# EasyEDA schematic SCH_Controller-12-volt-power_EasyEDA.json
TITLE: 12Volt Power for Controller; REV: 1.0; Date: 2024-10-01; Sheet: 1/1; Drawn By: scottguiness; Company: Scott and Marco
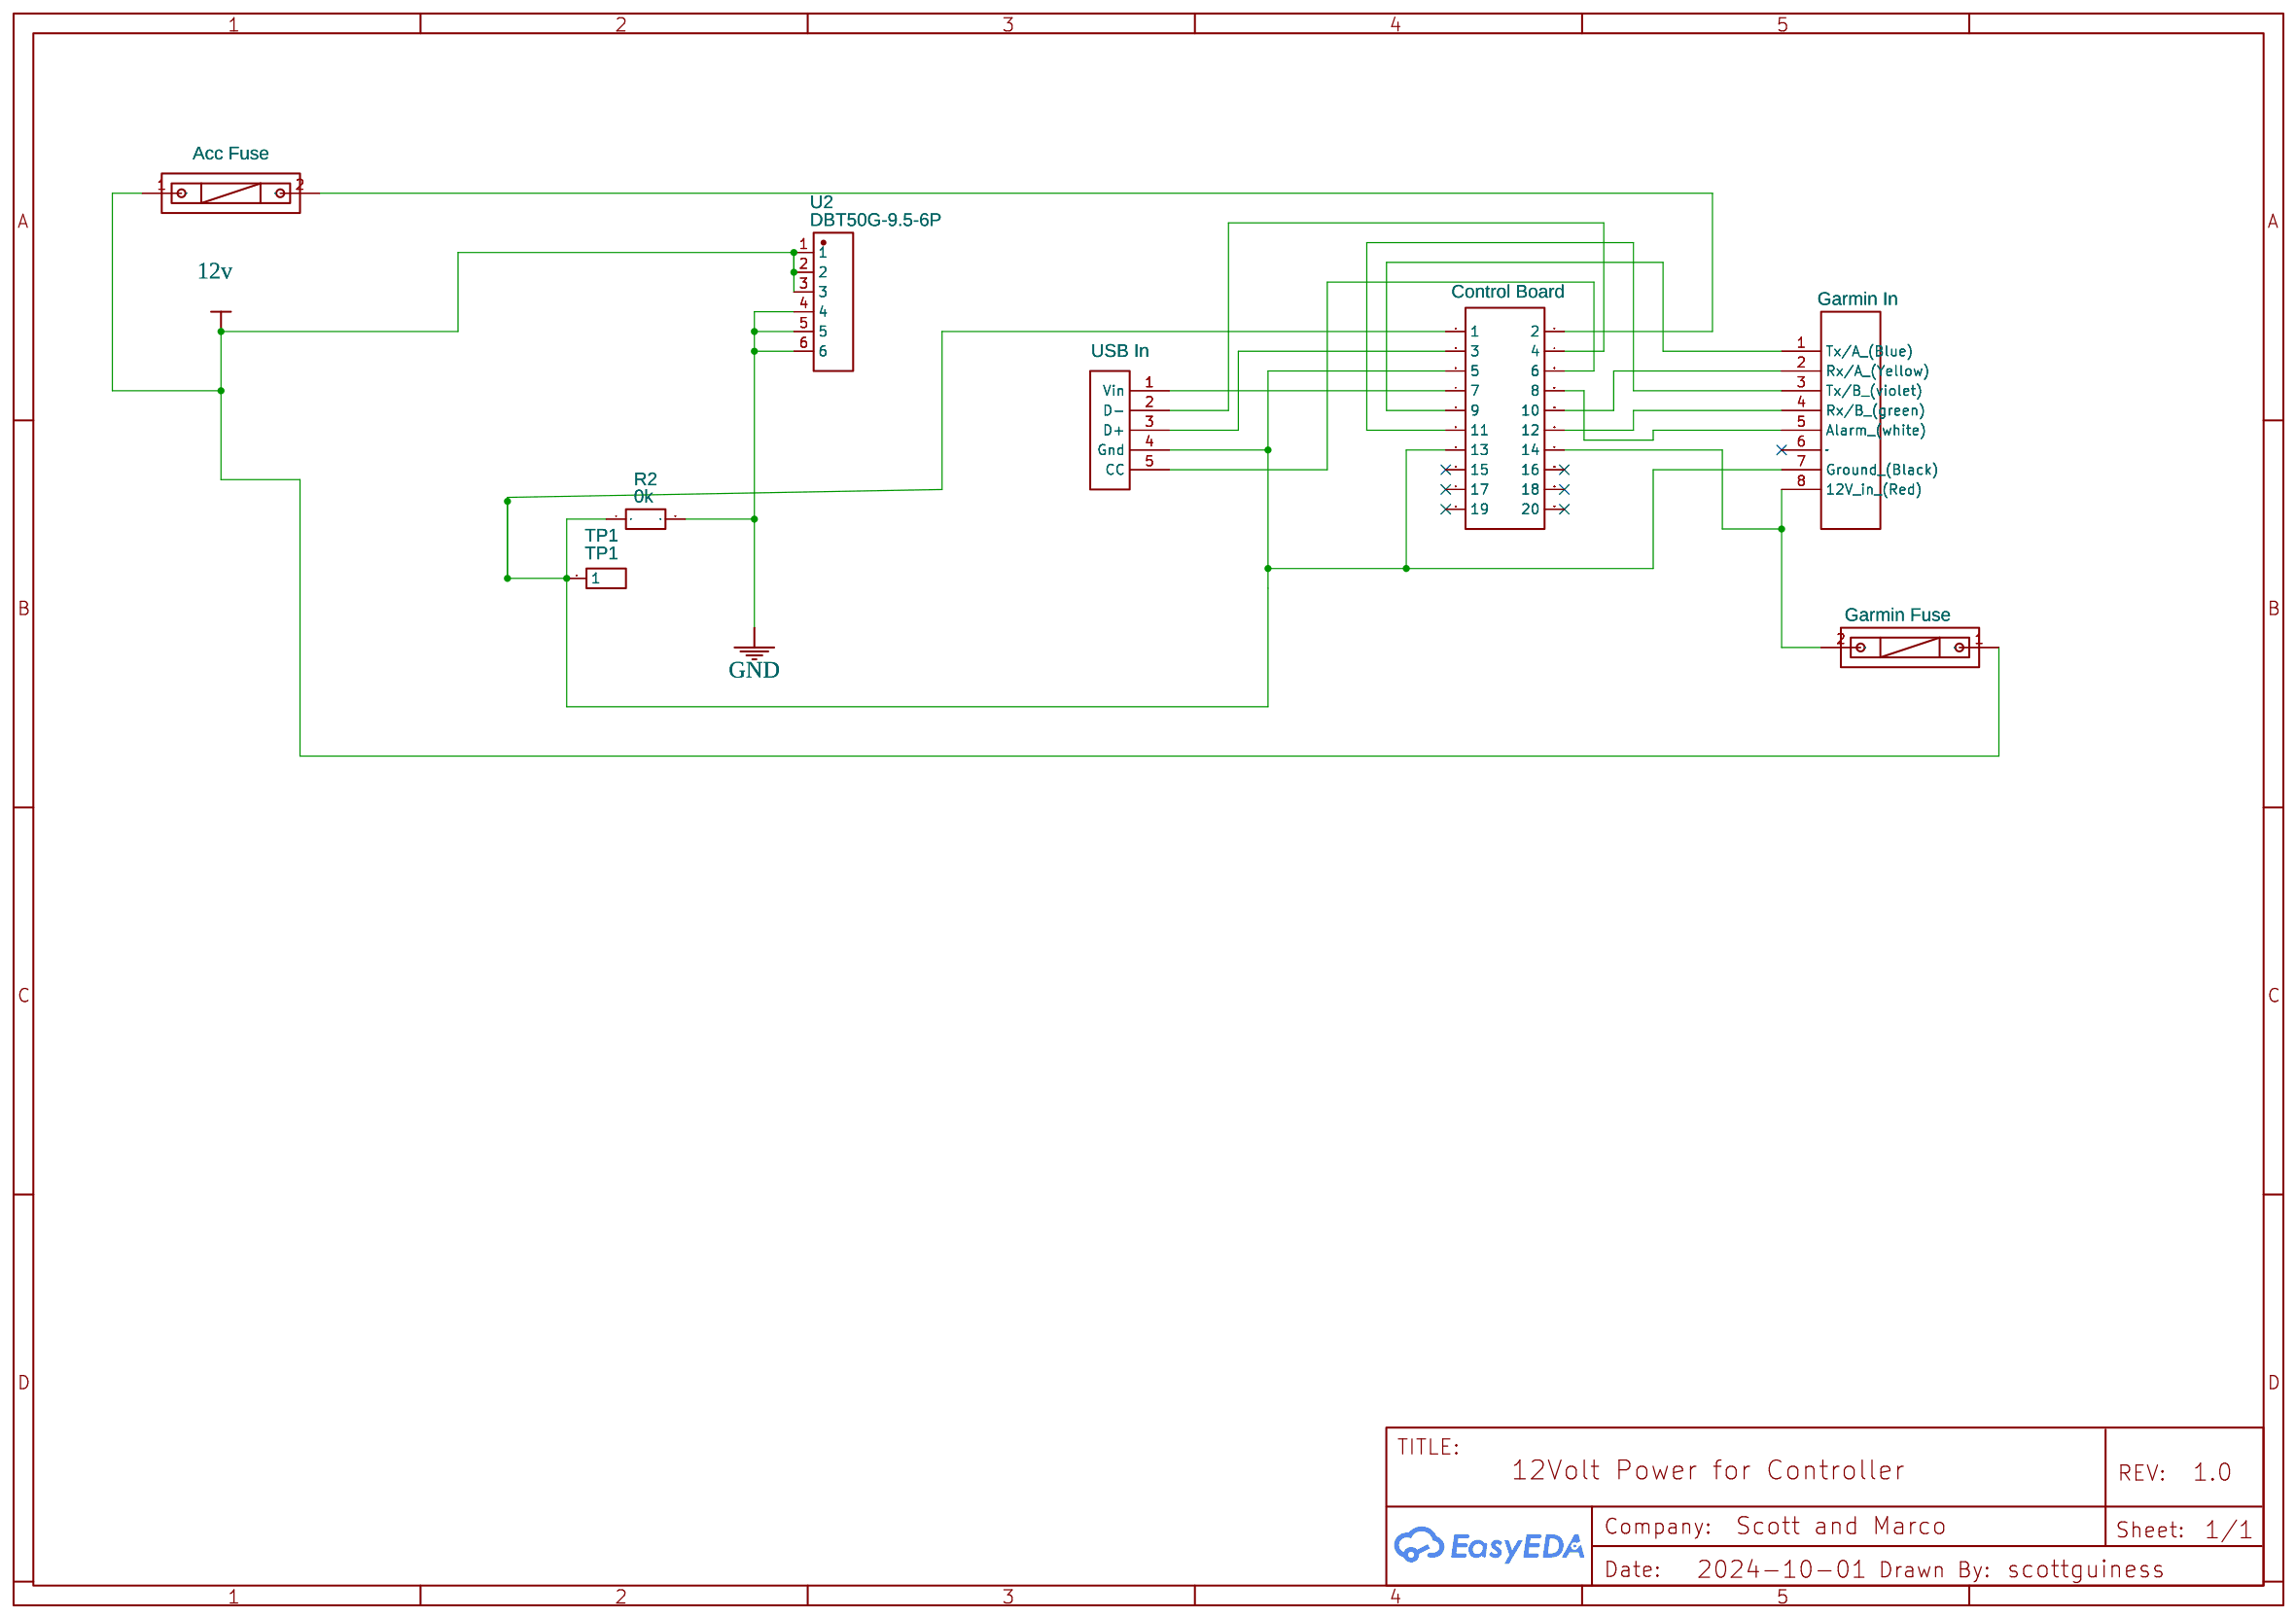
[diagram p0: schematic sheet]

## Parts
ACC-FUSE-5X20=BLX-ATYPE-FUSE-HOLDER  Acc Fuse  [FUSE-TH_L22.6-W9.0]
BUTTON_LED1  Control Board  [HDR-M-2.54_2X10]
GARMIN-FUSE-5X20-BLX-ATYPE-FUSE-HOLDER  Garmin Fuse  [FUSE-TH_L22.6-W9.0]
GARMIN-GPS  Garmin In  [JST-XH-8PIN-2.5]
R2  0k  [R_AXIAL-0.3]
TP1  TP1  [HDR-M-2.54_1X1]
U2  DBT50G-9.5-6P  [CONN-TH_6P-P9.50_DBT50G-9.5-6P]
USB-C  USB In  [JST XH 1X5]

## Library data of the parts
ACC-FUSE-5X20=BLX-ATYPE-FUSE-HOLDER GARMIN-FUSE-5X20-BLX-ATYPE-FUSE-HOLDER = 5x20 BLX-Atype Fuse holder XC-7: Supplier: LCSC; Manufacturer Part: 5x20 BLX-A型 保险丝支架 XC-7; Manufacturer: xcfuse(旭程); Supplier Part: C3131; JLCPCB Part Class: Extended Part
BUTTON_LED1 = HDR-M-2.54_2x10: Supplier Part: C124359; Supplier: LCSC; Contributor: LCEDA_Lib
GARMIN-GPS = 8PIN JST CONNECTOR: Manufacturer: Waveshare; Contributor: Robciog1968
R2 = R_AXIAL-0.3_EU: Contributor: LCEDA_Lib
TP1 = HDR-M-2.54_1x1: Supplier Part: C81276; Supplier: LCSC; Contributor: LCEDA_Lib; Package Display: No
U2 = DBT50G-9.5-6P: Contributor: LCSC; Supplier: LCSC; Supplier Part: C430698; Manufacturer: DORABO(地博电气); Manufacturer Part: DBT50G-9.5-6P-BK-P OGC; JLCPCB Part Class: Extended Part
USB-C = JST XH 1x5: Contributor: GeMeMe

## Nets
12v: ACC-FUSE-5X20=BLX-ATYPE-FUSE-HOLDER.1 GARMIN-FUSE-5X20-BLX-ATYPE-FUSE-HOLDER.1 U2.1 U2.2 U2.3
GND: R2.2 U2.4 U2.5 U2.6
Net-(ACC-FUSE-5X20=BLX-ATYPE-FUSE-HOLDER-2): ACC-FUSE-5X20=BLX-ATYPE-FUSE-HOLDER.2 BUTTON_LED1.2
Net-(BUTTON_LED1-1): BUTTON_LED1.1 BUTTON_LED1.5 BUTTON_LED1.13 GARMIN-GPS.7(Ground (Black)) R2.1 TP1.1 USB-C.4(Gnd)
Net-(BUTTON_LED1-3): BUTTON_LED1.3 USB-C.3(D+)
Net-(BUTTON_LED1-4): BUTTON_LED1.4 USB-C.2(D-)
Net-(BUTTON_LED1-6): BUTTON_LED1.6 USB-C.5(CC)
Net-(BUTTON_LED1-7): BUTTON_LED1.7 USB-C.1(Vin)
Net-(BUTTON_LED1-8): BUTTON_LED1.8 GARMIN-GPS.5(Alarm (white))
Net-(BUTTON_LED1-9): BUTTON_LED1.9 GARMIN-GPS.1(Tx/A (Blue))
Net-(BUTTON_LED1-10): BUTTON_LED1.10 GARMIN-GPS.2(Rx/A (Yellow))
Net-(BUTTON_LED1-11): BUTTON_LED1.11 GARMIN-GPS.3(Tx/B (violet))
Net-(BUTTON_LED1-12): BUTTON_LED1.12 GARMIN-GPS.4(Rx/B (green))
Net-(BUTTON_LED1-14): BUTTON_LED1.14 GARMIN-FUSE-5X20-BLX-ATYPE-FUSE-HOLDER.2 GARMIN-GPS.8(12V in (Red))

Not connected (* = marked no-connect by the designer): BUTTON_LED1 15* 16* 17* 18* 19* 20*; GARMIN-GPS 6(Accessory On)*
